# EAGLE schematic Extrudrboard2 (EAGLE 6.2)
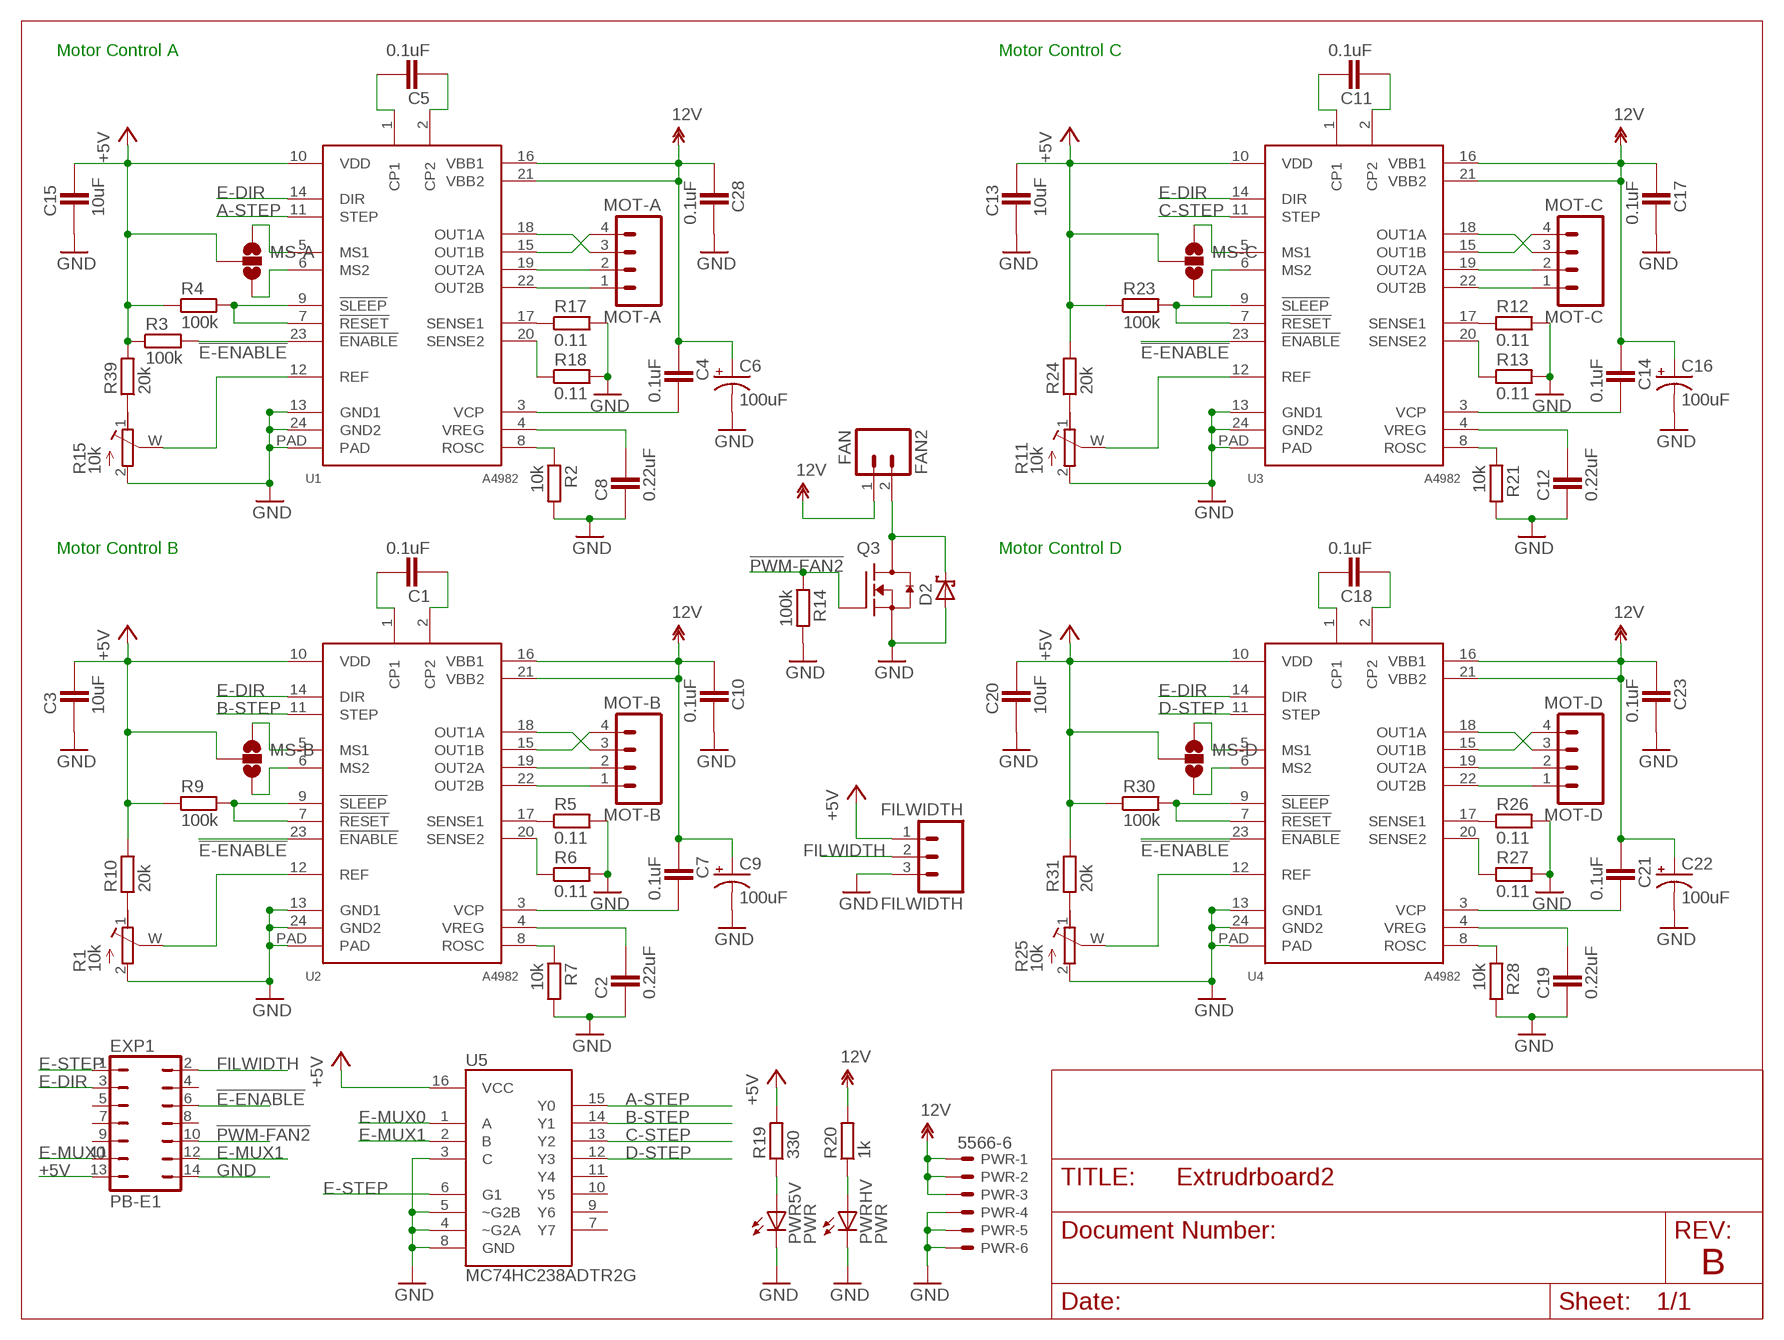
[diagram p0: schematic, sheet 1]

## Parts
C1  0.1uF  CAPACITOR_0805  [CAPC2012X145AN]
C2  0.22uF  CAPACITOR_0805  [CAPC2012X145AN]
C3  10uF  CAPACITOR_0805  [CAPC2012X145AN]
C4  0.1uF  CAPACITOR_0805  [CAPC2012X145AN]
C5  0.1uF  CAPACITOR_0805  [CAPC2012X145AN]
C6  100uF  CPOL-USD  [PANASONIC_D]
C7  0.1uF  CAPACITOR_0805  [CAPC2012X145AN]
C8  0.22uF  CAPACITOR_0805  [CAPC2012X145AN]
C9  100uF  CPOL-USD  [PANASONIC_D]
C10  0.1uF  CAPACITOR_0805  [CAPC2012X145AN]
C11  0.1uF  CAPACITOR_0805  [CAPC2012X145AN]
C12  0.22uF  CAPACITOR_0805  [CAPC2012X145AN]
C13  10uF  CAPACITOR_0805  [CAPC2012X145AN]
C14  0.1uF  CAPACITOR_0805  [CAPC2012X145AN]
C15  10uF  CAPACITOR_0805  [CAPC2012X145AN]
C16  100uF  CPOL-USD  [PANASONIC_D]
C17  0.1uF  CAPACITOR_0805  [CAPC2012X145AN]
C18  0.1uF  CAPACITOR_0805  [CAPC2012X145AN]
C19  0.22uF  CAPACITOR_0805  [CAPC2012X145AN]
C20  10uF  CAPACITOR_0805  [CAPC2012X145AN]
C21  0.1uF  CAPACITOR_0805  [CAPC2012X145AN]
C22  100uF  CPOL-USD  [PANASONIC_D]
C23  0.1uF  CAPACITOR_0805  [CAPC2012X145AN]
C28  0.1uF  CAPACITOR_0805  [CAPC2012X145AN]
D2  SCH-DIODESMA  [SMA]
EXP1  PB-E1  JP7Q  [JP7Q]
FAN2  FAN  M02PTH  [1X02]
FILWIDTH  FILWIDTH  M03PTH  [1X03]
MOT-A  MOT-A  M04POLAR  [MOLEX-1X4]
MOT-B  MOT-B  M04POLAR  [MOLEX-1X4]
MOT-C  MOT-C  M04POLAR  [MOLEX-1X4]
MOT-D  MOT-D  M04POLAR  [MOLEX-1X4]
MS-A  SOLDERJUMPER_2WAYCONNECTED  [SJ_3_CONNECTED]
MS-B  SOLDERJUMPER_2WAYCONNECTED  [SJ_3_CONNECTED]
MS-C  SOLDERJUMPER_2WAYCONNECTED  [SJ_3_CONNECTED]
MS-D  SOLDERJUMPER_2WAYCONNECTED  [SJ_3_CONNECTED]
PWR  5566-6  [5566-6]
PWR5V  PWR  LEDCHIP-LED0805  [CHIP-LED0805]
PWRHV  PWR  LEDCHIP-LED0805  [CHIP-LED0805]
Q3  RFP30N06LE  MOSFET-NCH_SOT-23  [SOT95P280X135-3N]
R1  10k  RTRIM-ST-4EA  [RTRIM-ST4ETB]
R2  10k  RESISTOR_0805  [RESC2012X70N]
R3  100k  RESISTOR_0805  [RESC2012X70N]
R4  100k  RESISTOR_0805  [RESC2012X70N]
R5  0.11  RESISTOR_0805  [RESC2012X70N]
R6  0.11  RESISTOR_0805  [RESC2012X70N]
R7  10k  RESISTOR_0805  [RESC2012X70N]
R9  100k  RESISTOR_0805  [RESC2012X70N]
R10  20k  RESISTOR_0805  [RESC2012X70N]
R11  10k  RTRIM-ST-4EA  [RTRIM-ST4ETB]
R12  0.11  RESISTOR_0805  [RESC2012X70N]
R13  0.11  RESISTOR_0805  [RESC2012X70N]
R14  100k  RESISTOR_0805  [RESC2012X70N]
R15  10k  RTRIM-ST-4EA  [RTRIM-ST4ETB]
R17  0.11  RESISTOR_0805  [RESC2012X70N]
R18  0.11  RESISTOR_0805  [RESC2012X70N]
R19  330  RESISTOR_0805  [RESC2012X70N]
R20  1k  RESISTOR_0805  [RESC2012X70N]
R21  10k  RESISTOR_0805  [RESC2012X70N]
R23  100k  RESISTOR_0805  [RESC2012X70N]
R24  20k  RESISTOR_0805  [RESC2012X70N]
R25  10k  RTRIM-ST-4EA  [RTRIM-ST4ETB]
R26  0.11  RESISTOR_0805  [RESC2012X70N]
R27  0.11  RESISTOR_0805  [RESC2012X70N]
R28  10k  RESISTOR_0805  [RESC2012X70N]
R30  100k  RESISTOR_0805  [RESC2012X70N]
R31  20k  RESISTOR_0805  [RESC2012X70N]
R39  20k  RESISTOR_0805  [RESC2012X70N]
U1  A4982  [TSSOP-24]
U2  A4982  [TSSOP-24]
U3  A4982  [TSSOP-24]
U4  A4982  [TSSOP-24]
U5  MC74HC238ADTR2G  M74HC238DT  [TSSOP16]

## Nets
12V: C4.1 C6.+ C7.1 C9.+ C10.1 C14.1 C16.+ C17.1 C21.1 C22.+ C23.1 C28.1 FAN2.1 PWR.1 PWR.2 PWR.3 R20.2 U1.16(VBB1) U1.21(VBB2) U2.16(VBB1) U2.21(VBB2) U3.16(VBB1) U3.21(VBB2) U4.16(VBB1) U4.21(VBB2)
!E-ENABLE: EXP1.6 R3.2 U1.23(!ENABLE) U2.23(!ENABLE) U3.23(!ENABLE) U4.23(!ENABLE)
!PWM-FAN2: EXP1.10 Q3.1(G) R14.1
+5V [power]: C3.2 C13.2 C15.2 C20.2 EXP1.13 FILWIDTH.1 MS-A.2 MS-B.2 MS-C.2 MS-D.2 R3.1 R4.1 R9.1 R10.2 R19.2 R23.1 R24.2 R30.1 R31.2 R39.2 U1.10(VDD) U2.10(VDD) U3.10(VDD) U4.10(VDD) U5.16(VCC)
A-STEP: U1.11(STEP) U5.15(Y0)
B-STEP: U2.11(STEP) U5.14(Y1)
C-STEP: U3.11(STEP) U5.13(Y2)
D-STEP: U4.11(STEP) U5.12(Y3)
E-DIR: EXP1.3 U1.14(DIR) U2.14(DIR) U3.14(DIR) U4.14(DIR)
E-MUX0: EXP1.11 U5.1(A)
E-MUX1: EXP1.12 U5.2(B)
E-STEP: EXP1.1 U5.6(G1)
FILWIDTH: EXP1.2 FILWIDTH.2
GND [power]: C2.1 C3.1 C6.- C8.1 C9.- C10.2 C12.1 C13.1 C15.1 C16.- C17.2 C19.1 C20.1 C22.- C23.2 C28.2 D2.A EXP1.14 FILWIDTH.3 PWR5V.C PWR.4 PWR.5 PWR.6 PWRHV.C Q3.2(S) R1.2(E) R2.2 R5.2 R6.2 R7.2 R11.2(E) R12.2 R13.2 R14.2 R15.2(E) R17.2 R18.2 R21.2 R25.2(E) R26.2 R27.2 R28.2 U1.13(GND1) U1.24(GND2) U1.PAD U2.13(GND1) U2.24(GND2) U2.PAD U3.13(GND1) U3.24(GND2) U3.PAD U4.13(GND1) U4.24(GND2) U4.PAD U5.3(C) U5.4(~G2A) U5.5(~G2B) U5.8(GND)
N$1: C1.2 U2.1(CP1)
N$2: C1.1 U2.2(CP2)
N$3: R5.1 U2.17(SENSE1)
N$4: R6.1 U2.20(SENSE2)
N$5: R1.W(S) U2.12(REF)
N$6: R7.1 U2.8(ROSC)
N$7: C2.2 U2.4(VREG)
N$8: R9.2 U2.7(!RESET) U2.9(!SLEEP)
N$9: C7.2 U2.3(VCP)
N$10: MOT-A.3 U1.18(OUT1A)
N$11: C5.2 U1.1(CP1)
N$12: C5.1 U1.2(CP2)
N$13: R2.1 U1.8(ROSC)
N$14: R17.1 U1.17(SENSE1)
N$15: R18.1 U1.20(SENSE2)
N$16: C4.2 U1.3(VCP)
N$17: MOT-A.4 U1.15(OUT1B)
N$18: R15.W(S) U1.12(REF)
N$19: C8.2 U1.4(VREG)
N$20: MOT-A.2 U1.19(OUT2A)
N$21: R4.2 U1.7(!RESET) U1.9(!SLEEP)
N$22: MS-B.1 U2.5(MS1)
N$23: MOT-A.1 U1.22(OUT2B)
N$24: MS-B.3 U2.6(MS2)
N$25: MOT-B.3 U2.18(OUT1A)
N$26: MOT-B.4 U2.15(OUT1B)
N$27: MS-A.1 U1.5(MS1)
N$28: MS-A.3 U1.6(MS2)
N$29: MOT-B.2 U2.19(OUT2A)
N$30: MOT-B.1 U2.22(OUT2B)
N$31: R1.1(A) R10.1
N$33: PWR5V.A R19.1
N$34: PWRHV.A R20.1
N$35: C11.2 U3.1(CP1)
N$36: C11.1 U3.2(CP2)
N$37: R12.1 U3.17(SENSE1)
N$38: R13.1 U3.20(SENSE2)
N$39: R11.W(S) U3.12(REF)
N$40: R21.1 U3.8(ROSC)
N$41: C12.2 U3.4(VREG)
N$42: R23.2 U3.7(!RESET) U3.9(!SLEEP)
N$43: C14.2 U3.3(VCP)
N$44: MS-C.1 U3.5(MS1)
N$45: MS-C.3 U3.6(MS2)
N$46: MOT-C.3 U3.18(OUT1A)
N$47: MOT-C.4 U3.15(OUT1B)
N$48: MOT-C.2 U3.19(OUT2A)
N$49: MOT-C.1 U3.22(OUT2B)
N$50: R11.1(A) R24.1
N$51: C18.2 U4.1(CP1)
N$52: C18.1 U4.2(CP2)
N$53: R26.1 U4.17(SENSE1)
N$54: R27.1 U4.20(SENSE2)
N$55: R25.W(S) U4.12(REF)
N$56: R28.1 U4.8(ROSC)
N$57: C19.2 U4.4(VREG)
N$58: R30.2 U4.7(!RESET) U4.9(!SLEEP)
N$59: C21.2 U4.3(VCP)
N$60: MS-D.1 U4.5(MS1)
N$61: MS-D.3 U4.6(MS2)
N$62: MOT-D.3 U4.18(OUT1A)
N$63: MOT-D.4 U4.15(OUT1B)
N$64: MOT-D.2 U4.19(OUT2A)
N$65: MOT-D.1 U4.22(OUT2B)
N$66: R25.1(A) R31.1
N$67: D2.C FAN2.2 Q3.3(D)
N$69: R15.1(A) R39.1
Unconnected: EXP1.4 EXP1.5 EXP1.7 EXP1.8 EXP1.9 U5.7(Y7) U5.9(Y6) U5.10(Y5) U5.11(Y4)

## Notes on the sheet
- Motor Control A | Motor Control C
- Motor Control B | Motor Control D
- B

## Library data of the parts
C1-C5 C7 C8 C10-C15 C17-C21 C23 C28 = ipc-7351-capacitor:CAPACITOR_
C6 C9 C16 C22 = rcl:CPOL-US: POLARIZED CAPACITOR, American symbol
D2 = printrbot:SCH-DIODE: Schottky Diodes Source: Fairchild .. BAT54.pdf
EXP1 = printrbot:JP7Q: JUMPER
FAN2 = SparkFun:M02: Header 2 Standard 2-pin 0.1" header. Use with straight break away headers (SKU : PRT-00116), right angle break away headers (PRT-00553), swiss pins (PRT-00743), machine pins (PRT-00117), and female headers (PRT-00115). Molex polarized connector foot print use with SKU : PRT-08233 with associated crimp pins and housings.
FILWIDTH = SparkFun:M03: Header 3 Standard 3-pin 0.1" header. Use with straight break away headers (SKU : PRT-00116), right angle break away headers (PRT-00553), swiss pins (PRT-00743), machine pins (PRT-00117), and female headers (PRT-00115). Molex polarized connector foot print use with SKU : PRT-08232 with associated crimp pins and housings.
MOT-A MOT-B MOT-C MOT-D = SparkFun:M04: Header 4 Standard 4-pin 0.1" header. Use with straight break away headers (SKU : PRT-00116), right angle break away headers (PRT-00553), swiss pins (PRT-00743), machine pins (PRT-00117), and female headers (PRT-00115). Molex polarized connector foot print use with SKU : PRT-08231 with associated crimp pins and housings. 1MM SMD Version SKU: PRT-10208
MS-A MS-B MS-C MS-D = printrbot:SOLDERJUMPER_2WAY: Solder Jumper 2 way solder jumper
PWR = printrbot:5566-6: Mini FIT connector 6 pol Source: http://www.molex.com; MPN: 95566-61002; OC_FARNELL: unknown; OC_NEWARK: 22K8620
PWR5V PWRHV = led:LED: LED OSRAM: - CHIPLED LG R971, LG N971, LY N971, LG Q971, LY Q971, LO R971, LY R971 LH N974, LH R974 LS Q976, LO Q976, LY Q976 LO Q996 - Hyper CHIPLED LW Q18S LB Q993, LB Q99A, LB R99A - SideLED LS A670, LO A670, LY A670, LG A670, LP A670 LB A673, LV A673, LT A673, LW A673 LH A674 LY A675 LS A676, LA A676, LO A676, LY A676, LW A676 LS A679, LY A679, LG A679 - Hyper Micro SIDELED® LS Y876, LA Y876, LO Y876, LY Y876 LT Y87S - SmartLED LW L88C, LW L88S LB L89C, LB L89S, LG L890 LS L89K, LO L89K, LY L89K LS L896, LA L896, LO L896, LY L896 - TOPLED LS T670, LO T670, LY T670, LG T670, LP T670 LSG T670, LSP T670, LSY T670, LOP T670, LYG T670 LG T671, LOG T671, LSG T671 LB T673, LV T673, LT T673, LW T673 LH T674 LS T676, LA T676, LO T676, LY T676, LB T676, LH T676, LSB T676, LW T676 LB T67C, LV T67C, LT T67C, LS T67K, LO T67K, LY T67K, LW E67C LS E67B, LA E67B, LO E67B, LY E67B, LB E67C, LV E67C, LT E67C LW T67C LS T679, LY T679, LG T679 LS T770, LO T770, LY T770, LG T770, LP T770 LB T773, LV T773, LT T773, LW T773 LH T774 LS E675, LA E675, LY E675, LS T675 LS T776, LA T776, LO T776, LY T776, LB T776 LHGB T686 LT T68C, LB T68C - Hyper Mini TOPLED® LB M676 - Mini TOPLED Santana® LG M470 LS M47K, LO M47K, LY M47K Source: http://www.osram.convergy.de LUXEON: - LUMILED® LXK2-PW12-R00, LXK2-PW12-S00, LXK2-PW14-U00, LXK2-PW14-V00 LXK2-PM12-R00, LXK2-PM12-S00, LXK2-PM14-U00 LXK2-PE12-Q00, LXK2-PE12-R00, LXK2-PE12-S00, LXK2-PE14-T00, LXK2-PE14-U00 LXK2-PB12-K00, LXK2-PB12-L00, LXK2-PB12-M00, LXK2-PB14-N00, LXK2-PB14-P00, LXK2-PB14-Q00 LXK2-PR12-L00, LXK2-PR12-M00, LXK2-PR14-Q00, LXK2-PR14-R00 LXK2-PD12-Q00, LXK2-PD12-R00, LXK2-PD12-S00 LXK2-PH12-R00, LXK2-PH12-S00 LXK2-PL12-P00, LXK2-PL12-Q00, LXK2-PL12-R00 Source: www.luxeon.com KINGBRIGHT: KA-3528ASYC Source: www.kingbright.com
Q3 = ipc-7351-transistor:MOSFET-NCH_
R1 R11 R15 R25 = printrbot:RTRIM-ST-4EA
R2-R7 R9 R10 R12-R14 R17-R21 R23 R24 R26-R28 R30 R31 R39 = ipc-7351-resistor:RESISTOR_
U1-U4 = printrbot:A4982
U5 = mux:M74HC238: M74HC238 - CMOS 3 TO 8 LINE DECODER RETIRED: IC-09771